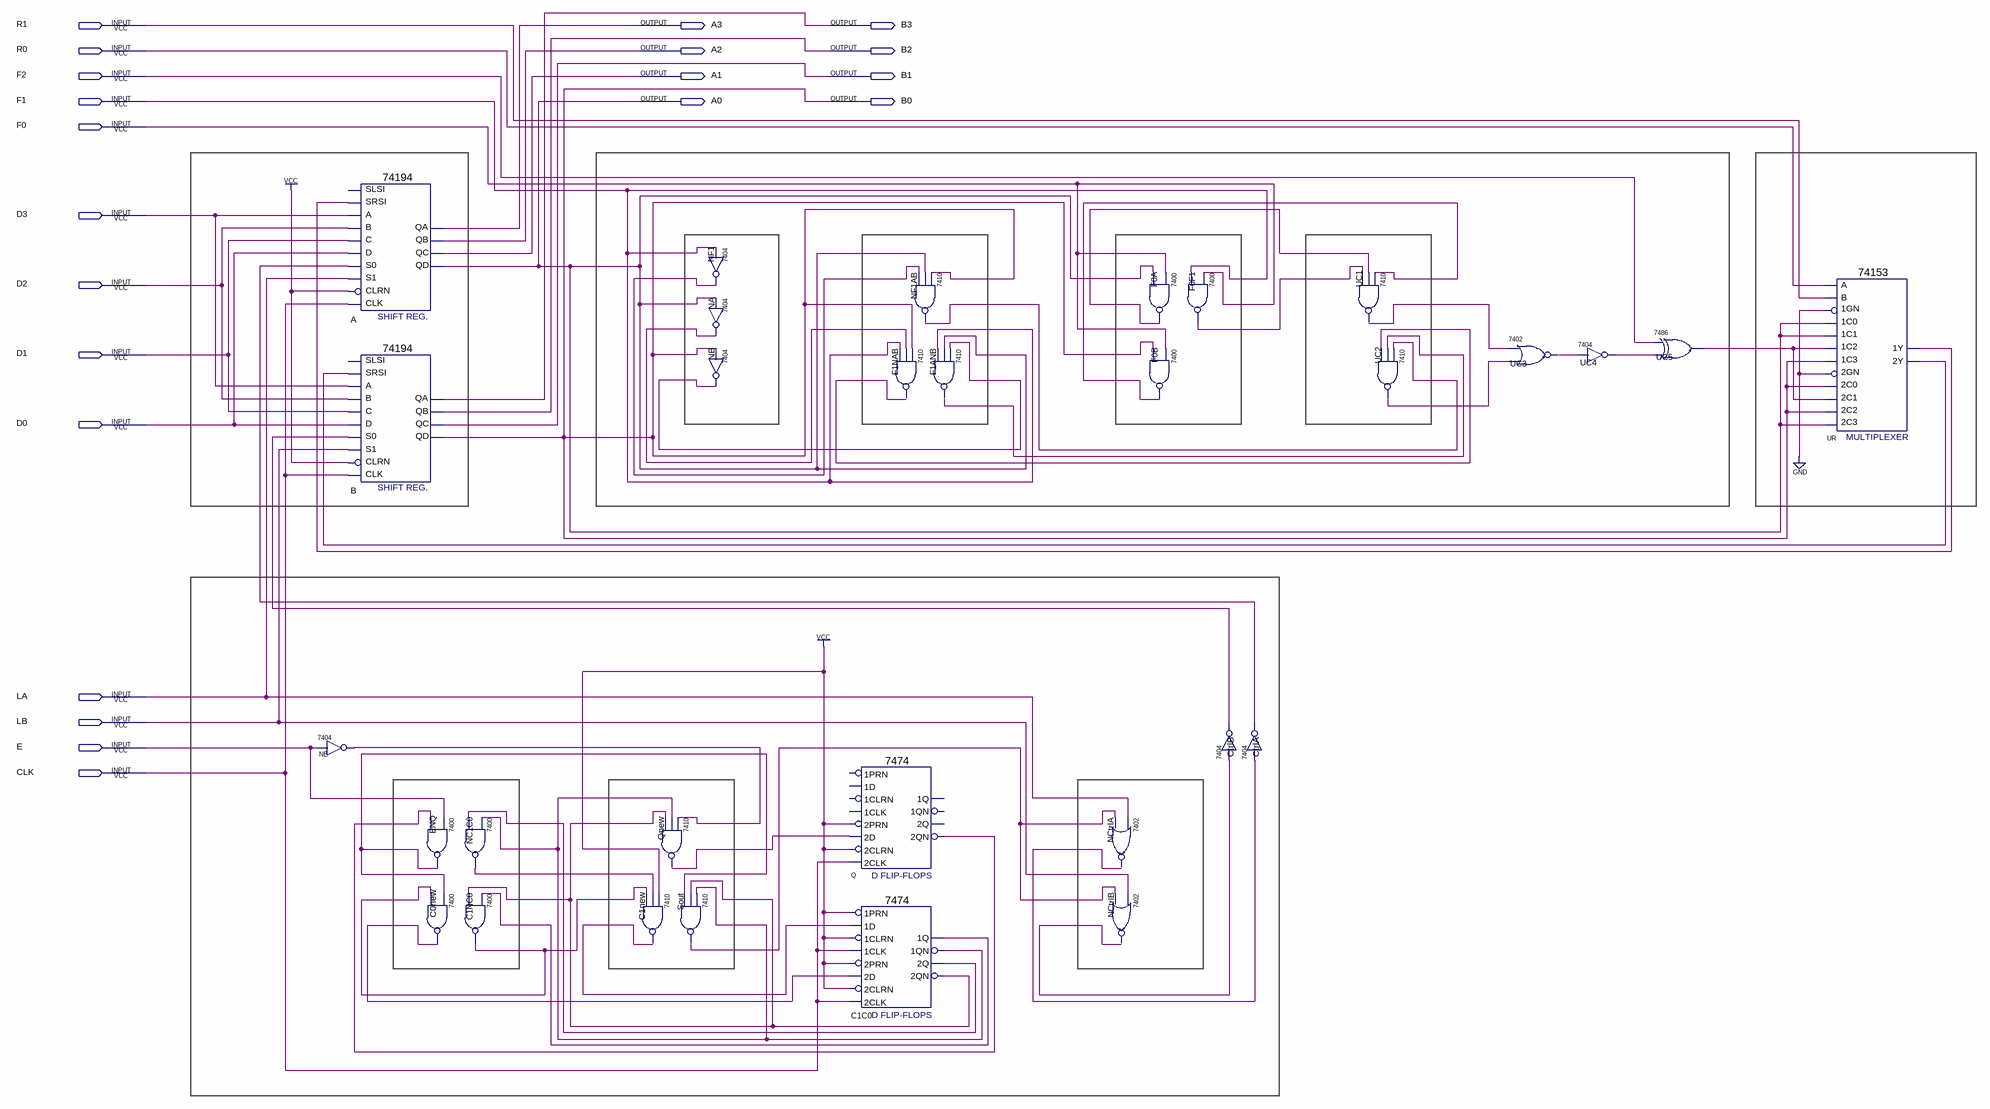
[diagram p0: schematic sheet]
// Quartus schematic ece385lab2.bdf as structural Verilog: 31 symbols, 21 pins
module ece385lab2 (
  input  R1,
  input  R0,
  input  F2,
  input  F1,
  input  F0,
  input  D3,
  input  D2,
  input  D1,
  input  D0,
  input  LA,
  input  LB,
  input  E,
  input  CLK,
  output A3,
  output B3,
  output A2,
  output B2,
  output A1,
  output B1,
  output A0,
  output B0
);

  wire C0new_1, C1C0_1q, C1C0_1qn, C1C0_2q, C1C0_2qn, C1NC0_1, C1new_1, CtrlA_1, CtrlB_1, ENQ_1, F0A_1,
       F0B_1, F0F1_1, F1ANB_1, F1NAB_1, NA_1, NB_1, NC1C0_1, NCtrlA_1, NCtrlB_1, NE_1, NF1_1, NF1AB_1, Q_2qn,
       Qnew_1, Sout_1, UC1_1, UC2_1, UC3_1, UC4_1, UC5_1, UR_1y, UR_2y;

  \74194  A (
    .SRSI(UR_1y), .B(D2), .C(D1), .CLK(CLK), .CLRN(1'b1), .D(D0), .S1(LA), .S0(CtrlA_1), .A(D3), .QA(A3),
    .QB(A2), .QC(A1), .QD(A0));  // open: SLSI
  \74194  B (
    .SRSI(UR_2y), .B(D2), .C(D1), .CLK(CLK), .CLRN(1'b1), .D(D0), .S1(LB), .S0(CtrlB_1), .A(D3), .QA(B3),
    .QB(B2), .QC(B1), .QD(B0));  // open: SLSI
  \7404  NE (.\2 (E), .\1 (NE_1));
  \7400  NC1C0 (.\3 (C1C0_2q), .\2 (C1C0_1qn), .\1 (NC1C0_1));
  \7400  ENQ (.\3 (Q_2qn), .\2 (E), .\1 (ENQ_1));
  \7400  C1NC0 (.\3 (C1C0_2qn), .\2 (C1C0_1q), .\1 (C1NC0_1));
  \7400  C0new (.\3 (C1NC0_1), .\2 (ENQ_1), .\1 (C0new_1));
  \7410  Qnew (.\2 (NE_1), .\3 (C1C0_1qn), .\4 (C1C0_2qn), .\1 (Qnew_1));
  \7410  C1new (.\2 (1'b1), .\3 (NC1C0_1), .\4 (C1NC0_1), .\1 (C1new_1));
  \7404  NF1 (.\2 (F1), .\1 (NF1_1));
  \7404  NA (.\2 (A0), .\1 (NA_1));
  \7404  NB (.\2 (B0), .\1 (NB_1));
  \7410  Sout (.\2 (C1C0_1qn), .\3 (C1C0_2qn), .\4 (ENQ_1), .\1 (Sout_1));
  \7474  Q (
    .\2D (Qnew_1), .\2PRN (1'b1), .\2CLK (CLK), .\2CLRN (1'b1), .\2QN (Q_2qn));  // open: 1CLK, 1D, 1PRN, 1CLRN, 1QN, 2Q, 1Q
  \7474  C1C0 (
    .\2D (C0new_1), .\2PRN (1'b1), .\1CLK (CLK), .\1D (C1new_1), .\1PRN (1'b1), .\2CLK (CLK), .\2CLRN (1'b1),
    .\1CLRN (1'b1), .\1QN (C1C0_1qn), .\2Q (C1C0_2q), .\2QN (C1C0_2qn), .\1Q (C1C0_1q));
  \7410  NF1AB (.\2 (B0), .\3 (A0), .\4 (NF1_1), .\1 (NF1AB_1));
  \7410  F1NAB (.\2 (B0), .\3 (NA_1), .\4 (F1), .\1 (F1NAB_1));
  \7410  F1ANB (.\2 (NB_1), .\3 (A0), .\4 (F1), .\1 (F1ANB_1));
  \7402  NCtrlA (.\2 (LA), .\3 (Sout_1), .\1 (NCtrlA_1));
  \7402  NCtrlB (.\2 (LB), .\3 (Sout_1), .\1 (NCtrlB_1));
  \7400  F0A (.\3 (A0), .\2 (F0), .\1 (F0A_1));
  \7400  F0B (.\3 (B0), .\2 (F0), .\1 (F0B_1));
  \7400  F0F1 (.\3 (F1), .\2 (F0), .\1 (F0F1_1));
  \7404  CtrlB (.\2 (NCtrlB_1), .\1 (CtrlB_1));
  \7404  CtrlA (.\2 (NCtrlA_1), .\1 (CtrlA_1));
  \7410  UC1 (.\2 (F0B_1), .\3 (F0A_1), .\4 (F0F1_1), .\1 (UC1_1));
  \7410  UC2 (.\2 (NF1AB_1), .\3 (F1ANB_1), .\4 (F1NAB_1), .\1 (UC2_1));
  \7402  UC3 (.\2 (UC1_1), .\3 (UC2_1), .\1 (UC3_1));
  \7404  UC4 (.\2 (UC3_1), .\1 (UC4_1));
  \7486  UC5 (.\2 (F2), .\3 (UC4_1), .\1 (UC5_1));
  \74153  UR (
    .\1C1 (A0), .\1GN (1'b0), .\1C0 (A0), .\2C0 (B0), .\2GN (1'b0), .\2C2 (B0), .\1C2 (UC5_1), .\1C3 (B0),
    .B(R1), .A(R0), .\2C1 (UC5_1), .\2C3 (A0), .\1Y (UR_1y), .\2Y (UR_2y));
endmodule
